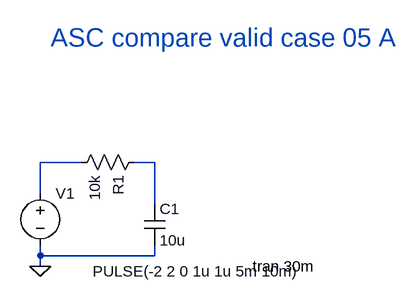
[diagram p0: schematic valid_case_05_a.asc]
valid_case_05_a.asc, the LTspice schematic file:
Version 4.1
SHEET 1 880 680
WIRE 128 96 64 96
WIRE 240 96 208 96
WIRE 64 144 64 96
WIRE 240 160 240 96
WIRE 64 240 64 224
WIRE 240 240 240 224
WIRE 240 240 64 240
WIRE 64 256 64 240
FLAG 64 256 0
SYMBOL res 224 80 R90
SYMATTR InstName R1
SYMATTR Value 10k
SYMBOL cap 224 160 R0
SYMATTR InstName C1
SYMATTR Value 10u
SYMBOL voltage 64 128 R0
WINDOW 123 0 0 Left 2
WINDOW 39 0 0 Left 2
WINDOW 3 81 136 Left 2
SYMATTR InstName V1
SYMATTR Value PULSE(-2 2 0 1u 1u 5m 10m)
TEXT 384 256 Left 2 !.tran 30m
TEXT 80 -96 Left 4 ;ASC compare valid case 05 A

The netlist it stands for:
* valid_case_05_a.asc
R1 N002 N001 10k
C1 N002 0 10u
V1 N001 0 PULSE(-2 2 0 1u 1u 5m 10m)
.tran 30m
* ASC compare valid case 05 A
.backanno
.end